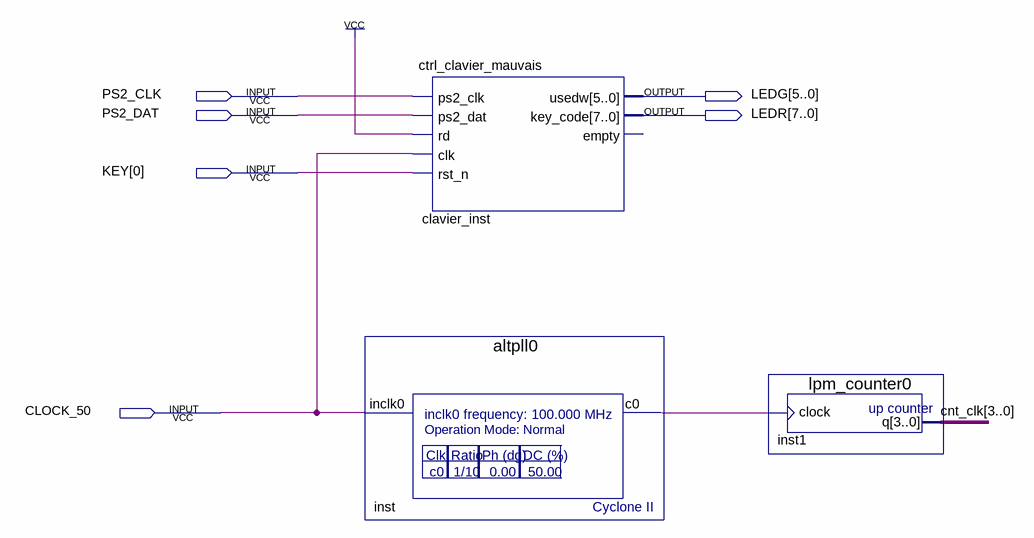
[diagram p0: schematic sheet]
// Quartus schematic partie2_top.bdf as structural Verilog: 3 symbols, 6 pins
module partie2_top (
  input  PS2_CLK,
  input  PS2_DAT,
  input  [0:0] KEY,
  input  CLOCK_50,
  output [5:0] LEDG,
  output [7:0] LEDR
);

  wire inst_c0;
  wire [3:0] cnt_clk;

  altpll0 inst (.inclk0(CLOCK_50), .c0(inst_c0));
  ctrl_clavier_mauvais clavier_inst (
    .ps2_clk(PS2_CLK), .ps2_dat(PS2_DAT), .rd(1'b1), .clk(CLOCK_50), .rst_n(KEY[0]), .usedw(LEDG),
    .key_code(LEDR));  // open: empty
  lpm_counter0 inst1 (.clock(inst_c0), .q(cnt_clk));
endmodule
